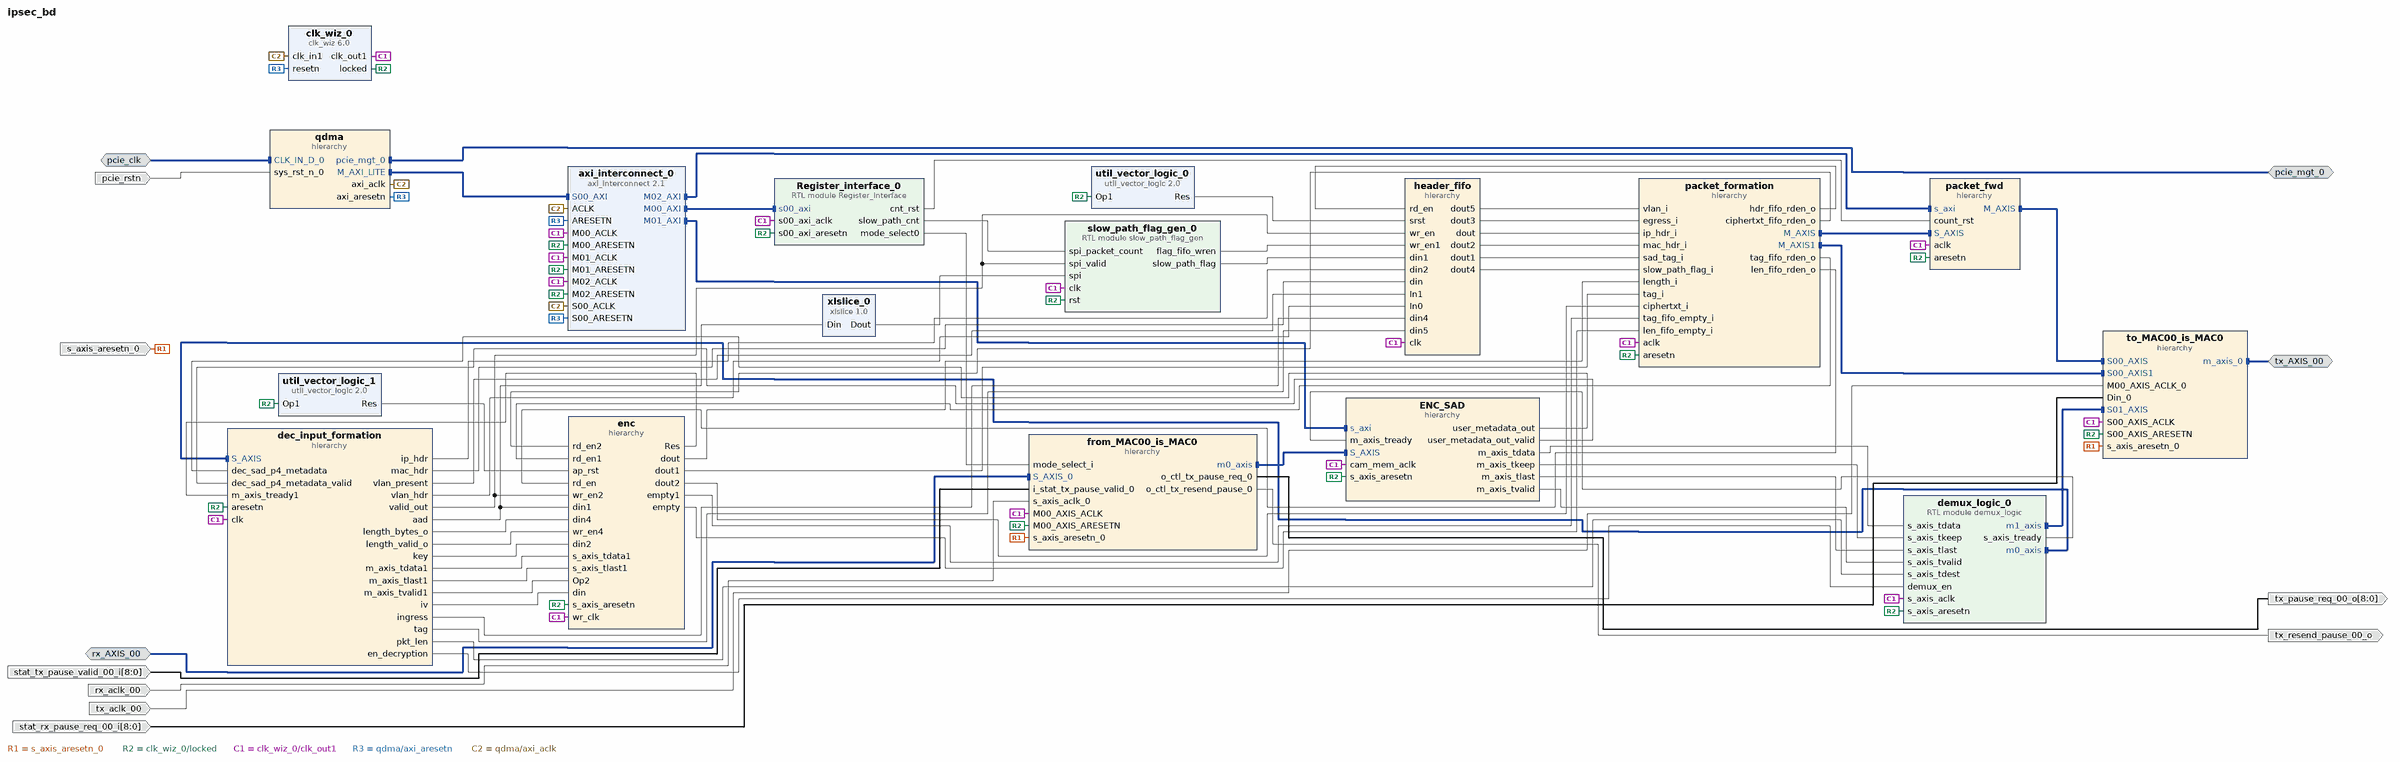
[diagram p0: block diagram of the top level]
# Vivado block design ipsec_bd, xcu25-ffvc1760-2LV-e, Vivado 2020.1_AR75245
create_bd_design ipsec_bd

create_bd_intf_port -mode Slave -vlnv xilinx.com:interface:diff_clock_rtl:1.0 pcie_clk
create_bd_intf_port -mode Master -vlnv xilinx.com:interface:pcie_7x_mgt_rtl:1.0 pcie_mgt_0
create_bd_intf_port -mode Slave -vlnv xilinx.com:interface:axis_rtl:1.0 rx_AXIS_00
set_property -dict [list \
  CONFIG.TDATA_NUM_BYTES 8 \
  CONFIG.TDEST_WIDTH 0 \
  CONFIG.TID_WIDTH 0 \
  CONFIG.TUSER_WIDTH 0 \
  CONFIG.HAS_TREADY 1 \
  CONFIG.HAS_TSTRB 0 \
  CONFIG.HAS_TKEEP 1 \
  CONFIG.HAS_TLAST 1 \
  CONFIG.LAYERED_METADATA undef \
] [get_bd_intf_ports rx_AXIS_00]
create_bd_intf_port -mode Master -vlnv xilinx.com:interface:axis_rtl:1.0 tx_AXIS_00
create_bd_port -dir I -type rst pcie_rstn
create_bd_port -dir O -from 8 -to 0 tx_pause_req_00_o
create_bd_port -dir O tx_resend_pause_00_o
create_bd_port -dir I -from 8 -to 0 stat_tx_pause_valid_00_i
create_bd_port -dir I -type rst s_axis_aresetn_0
create_bd_port -dir I -type clk rx_aclk_00
create_bd_port -dir I -type clk tx_aclk_00
create_bd_port -dir I -from 8 -to 0 stat_rx_pause_req_00_i

create_bd_cell -type ip -vlnv xilinx.com:ip:util_vector_logic:2.0 util_vector_logic_0
set_property -dict {CONFIG.C_OPERATION not CONFIG.C_SIZE 1} [get_bd_cells util_vector_logic_0]
create_bd_cell -type hier header_fifo
create_bd_cell -type hier ENC_SAD
create_bd_cell -type hier dec_input_formation
create_bd_cell -type hier enc
create_bd_cell -type hier packet_formation
create_bd_cell -type hier packet_fwd
create_bd_cell -type ip -vlnv xilinx.com:ip:axi_interconnect:2.1 axi_interconnect_0
set_property -dict {CONFIG.M02_HAS_REGSLICE 1 CONFIG.NUM_MI 3} [get_bd_cells axi_interconnect_0]
create_bd_cell -type hier qdma
create_bd_cell -type hier from_MAC00_is_MAC0
create_bd_cell -type hier to_MAC00_is_MAC0
create_bd_cell -type ip -vlnv xilinx.com:ip:clk_wiz:6.0 clk_wiz_0
set_property -dict [list \
  CONFIG.CLKIN1_JITTER_PS 40.0 \
  CONFIG.CLKOUT1_DRIVES Buffer \
  CONFIG.CLKOUT1_JITTER 93.465 \
  CONFIG.CLKOUT1_PHASE_ERROR 89.345 \
  CONFIG.CLKOUT1_REQUESTED_OUT_FREQ 333.33333 \
  CONFIG.CLKOUT2_DRIVES Buffer \
  CONFIG.CLKOUT3_DRIVES Buffer \
  CONFIG.CLKOUT4_DRIVES Buffer \
  CONFIG.CLKOUT5_DRIVES Buffer \
  CONFIG.CLKOUT6_DRIVES Buffer \
  CONFIG.CLKOUT7_DRIVES Buffer \
  CONFIG.FEEDBACK_SOURCE FDBK_AUTO \
  CONFIG.MMCM_BANDWIDTH OPTIMIZED \
  CONFIG.MMCM_CLKFBOUT_MULT_F 14.500 \
  CONFIG.MMCM_CLKIN1_PERIOD 4.000 \
  CONFIG.MMCM_CLKIN2_PERIOD 10.0 \
  CONFIG.MMCM_CLKOUT0_DIVIDE_F 3.625 \
  CONFIG.MMCM_COMPENSATION AUTO \
  CONFIG.MMCM_DIVCLK_DIVIDE 3 \
  CONFIG.PRIMITIVE MMCM \
  CONFIG.PRIM_IN_FREQ 250.000 \
  CONFIG.RESET_PORT resetn \
  CONFIG.RESET_TYPE ACTIVE_LOW \
] [get_bd_cells clk_wiz_0]
create_bd_cell -type ip -vlnv xilinx.com:ip:util_vector_logic:2.0 util_vector_logic_1
set_property -dict {CONFIG.C_OPERATION not CONFIG.C_SIZE 1} [get_bd_cells util_vector_logic_1]
create_bd_cell -type module -reference demux_logic demux_logic_0
create_bd_cell -type module -reference slow_path_flag_gen slow_path_flag_gen_0
create_bd_cell -type ip -vlnv xilinx.com:ip:xlslice:1.0 xlslice_0
set_property -dict {CONFIG.DIN_FROM 31 CONFIG.DIN_WIDTH 64 CONFIG.DOUT_WIDTH 32} [get_bd_cells xlslice_0]
create_bd_cell -type module -reference Register_interface Register_interface_0

# ---- hierarchy /header_fifo ----
current_bd_instance /header_fifo
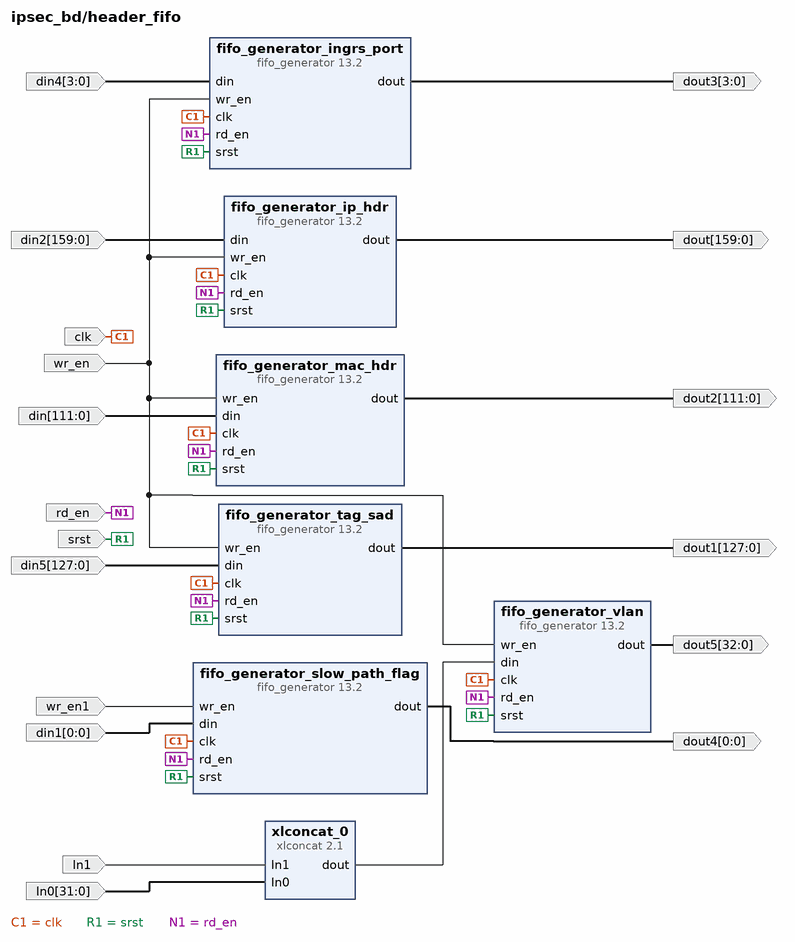
[diagram p1: block diagram inside /header_fifo]
create_bd_pin -dir I -type clk clk
create_bd_pin -dir I srst
create_bd_pin -dir I -from 111 -to 0 din
create_bd_pin -dir I wr_en
create_bd_pin -dir I -from 159 -to 0 din2
create_bd_pin -dir O -from 159 -to 0 dout
create_bd_pin -dir I rd_en
create_bd_pin -dir O -from 111 -to 0 dout2
create_bd_pin -dir I In1
create_bd_pin -dir I -from 31 -to 0 In0
create_bd_pin -dir O -from 32 -to 0 dout5
create_bd_pin -dir O -from 3 -to 0 dout3
create_bd_pin -dir I -from 3 -to 0 din4
create_bd_pin -dir I -from 127 -to 0 din5
create_bd_pin -dir I wr_en1
create_bd_pin -dir I -from 0 -to 0 din1
create_bd_pin -dir O -from 127 -to 0 dout1
create_bd_pin -dir O -from 0 -to 0 dout4

create_bd_cell -type ip -vlnv xilinx.com:ip:fifo_generator:13.2 fifo_generator_mac_hdr
set_property -dict [list \
  CONFIG.Fifo_Implementation Common_Clock_Block_RAM \
  CONFIG.Input_Data_Width 112 \
  CONFIG.Input_Depth 128 \
  CONFIG.Use_Embedded_Registers false \
] [get_bd_cells fifo_generator_mac_hdr]
create_bd_cell -type ip -vlnv xilinx.com:ip:fifo_generator:13.2 fifo_generator_ip_hdr
set_property -dict [list \
  CONFIG.Fifo_Implementation Common_Clock_Block_RAM \
  CONFIG.Input_Data_Width 160 \
  CONFIG.Input_Depth 128 \
  CONFIG.Use_Embedded_Registers false \
] [get_bd_cells fifo_generator_ip_hdr]
create_bd_cell -type ip -vlnv xilinx.com:ip:xlconcat:2.1 xlconcat_0
set_property -dict {CONFIG.IN0_WIDTH 32 CONFIG.IN1_WIDTH 1} [get_bd_cells xlconcat_0]
create_bd_cell -type ip -vlnv xilinx.com:ip:fifo_generator:13.2 fifo_generator_vlan
set_property -dict [list \
  CONFIG.Fifo_Implementation Common_Clock_Builtin_FIFO \
  CONFIG.Input_Data_Width 33 \
  CONFIG.Input_Depth 512 \
  CONFIG.Performance_Options Standard_FIFO \
  CONFIG.Use_Embedded_Registers false \
] [get_bd_cells fifo_generator_vlan]
create_bd_cell -type ip -vlnv xilinx.com:ip:fifo_generator:13.2 fifo_generator_ingrs_port
set_property -dict [list \
  CONFIG.Fifo_Implementation Common_Clock_Block_RAM \
  CONFIG.Input_Data_Width 4 \
  CONFIG.Input_Depth 128 \
  CONFIG.Performance_Options Standard_FIFO \
  CONFIG.Use_Embedded_Registers false \
] [get_bd_cells fifo_generator_ingrs_port]
create_bd_cell -type ip -vlnv xilinx.com:ip:fifo_generator:13.2 fifo_generator_tag_sad
set_property -dict [list \
  CONFIG.Fifo_Implementation Common_Clock_Block_RAM \
  CONFIG.Input_Data_Width 128 \
  CONFIG.Input_Depth 128 \
  CONFIG.Performance_Options Standard_FIFO \
  CONFIG.Use_Embedded_Registers false \
] [get_bd_cells fifo_generator_tag_sad]
create_bd_cell -type ip -vlnv xilinx.com:ip:fifo_generator:13.2 fifo_generator_slow_path_flag
set_property -dict [list \
  CONFIG.Fifo_Implementation Common_Clock_Block_RAM \
  CONFIG.Input_Data_Width 1 \
  CONFIG.Input_Depth 128 \
  CONFIG.Performance_Options Standard_FIFO \
  CONFIG.Use_Embedded_Registers false \
] [get_bd_cells fifo_generator_slow_path_flag]

# ---- hierarchy /ENC_SAD ----
current_bd_instance /ENC_SAD
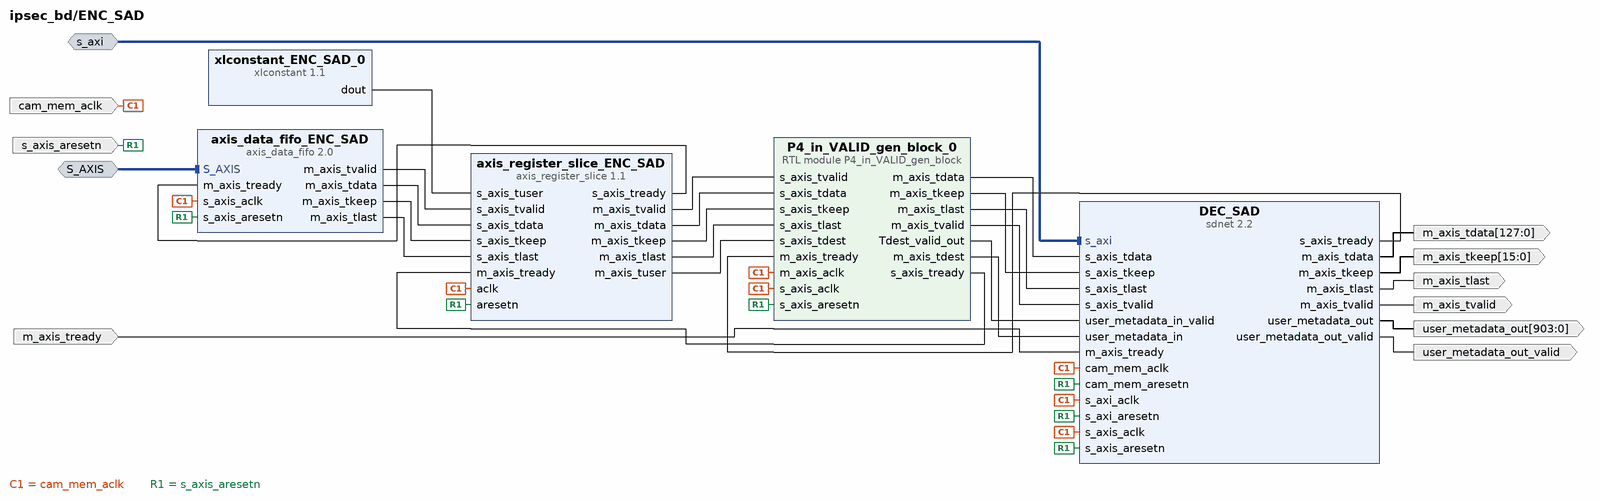
[diagram p2: block diagram inside /ENC_SAD]
create_bd_intf_pin -mode Slave -vlnv xilinx.com:interface:aximm_rtl:1.0 s_axi
create_bd_intf_pin -mode Slave -vlnv xilinx.com:interface:axis_rtl:1.0 S_AXIS
create_bd_pin -dir I -type clk cam_mem_aclk
create_bd_pin -dir I -type rst s_axis_aresetn
create_bd_pin -dir O -from 127 -to 0 m_axis_tdata
create_bd_pin -dir O -from 15 -to 0 m_axis_tkeep
create_bd_pin -dir O m_axis_tlast
create_bd_pin -dir O m_axis_tvalid
create_bd_pin -dir I m_axis_tready
create_bd_pin -dir O -from 903 -to 0 user_metadata_out
create_bd_pin -dir O user_metadata_out_valid

create_bd_cell -type ip -vlnv xilinx.com:ip:axis_register_slice:1.1 axis_register_slice_ENC_SAD
set_property -dict [list \
  CONFIG.HAS_TKEEP 1 \
  CONFIG.HAS_TLAST 1 \
  CONFIG.TDATA_NUM_BYTES 16 \
  CONFIG.TUSER_WIDTH 904 \
] [get_bd_cells axis_register_slice_ENC_SAD]
create_bd_cell -type ip -vlnv xilinx.com:ip:xlconstant:1.1 xlconstant_ENC_SAD_0
set_property -dict {CONFIG.CONST_VAL 0 CONFIG.CONST_WIDTH 904} [get_bd_cells xlconstant_ENC_SAD_0]
create_bd_cell -type ip -vlnv xilinx.com:ip:axis_data_fifo:2.0 axis_data_fifo_ENC_SAD
set_property -dict [list \
  CONFIG.FIFO_DEPTH 64 \
  CONFIG.HAS_TKEEP 1 \
  CONFIG.HAS_TLAST 1 \
  CONFIG.TDATA_NUM_BYTES 16 \
] [get_bd_cells axis_data_fifo_ENC_SAD]
create_bd_cell -type module -reference P4_in_VALID_gen_block P4_in_VALID_gen_block_0
set_property -dict {CONFIG.TDEST_SIZE 904} [get_bd_cells P4_in_VALID_gen_block_0]
create_bd_cell -type ip -vlnv xilinx.com:ip:sdnet:2.2 DEC_SAD
set_property -dict [list \
  CONFIG.AXIS_CLK_FREQ_MHZ 333 \
  CONFIG.CAM_MEM_CLK_ENABLE 1 \
  CONFIG.CAM_TABLE_PARAMS {MyProcessing.sad {ram_style GLOBAL clock CAM mode BCAM opt GLOBAL}} \
  CONFIG.JSON_TIMESTAMP 1601540136 \
  CONFIG.M_AXI_HBM_ADDR_WIDTH 33 \
  CONFIG.M_AXI_HBM_DATA_WIDTH 256 \
  CONFIG.M_AXI_HBM_ID_WIDTH 6 \
  CONFIG.M_AXI_HBM_PROTOCOL 0 \
  CONFIG.P4_FILE /home/merin.baby/merin/xilu_u25b_ipsec/IPSEC_DEC_C0_08/IP/p4/sad_dec_new_A0_00.p4 \
  CONFIG.PKT_RATE 150 \
  CONFIG.S_AXI_ADDR_WIDTH 13 \
  CONFIG.TDATA_NUM_BYTES 16 \
  CONFIG.USER_METADATA_ENABLES {metadata.ingress_port {input true output true} metadata.length {input true output true} metadata.ip_header {input true output true} metadata.vlan_header {input true output true} metadata.mac_header {input true output true} metadata.tag_met {input true output true} metadata.iv {input true output true} metadata.aad {input true output true} metadata.int_iv {input true output true} metadata.dec_key {input true output true} metadata.is_vlan {input true output true} metadata.en_fwd {input true output true} metadata.en_encrypt {input true output true} metadata.hit_test {input true output true}} \
  CONFIG.USER_META_DATA_WIDTH 904 \
  CONFIG.USER_META_FORMAT {metadata.ingress_port {length 4 start 0 end 3} metadata.length {length 16 start 4 end 19} metadata.ip_header {length 160 start 20 end 179} metadata.vlan_header {length 32 start 180 end 211} metadata.mac_header {length 112 start 212 end 323} metadata.tag_met {length 128 start 324 end 451} metadata.iv {length 96 start 452 end 547} metadata.aad {length 64 start 548 end 611} metadata.int_iv {length 32 start 612 end 643} metadata.dec_key {length 256 start 644 end 899} metadata.is_vlan {length 1 start 900 end 900} metadata.en_fwd {length 1 start 901 end 901} metadata.en_encrypt {length 1 start 902 end 902} metadata.hit_test {length 1 start 903 end 903}} \
] [get_bd_cells DEC_SAD]

# ---- hierarchy /dec_input_formation ----
current_bd_instance /dec_input_formation
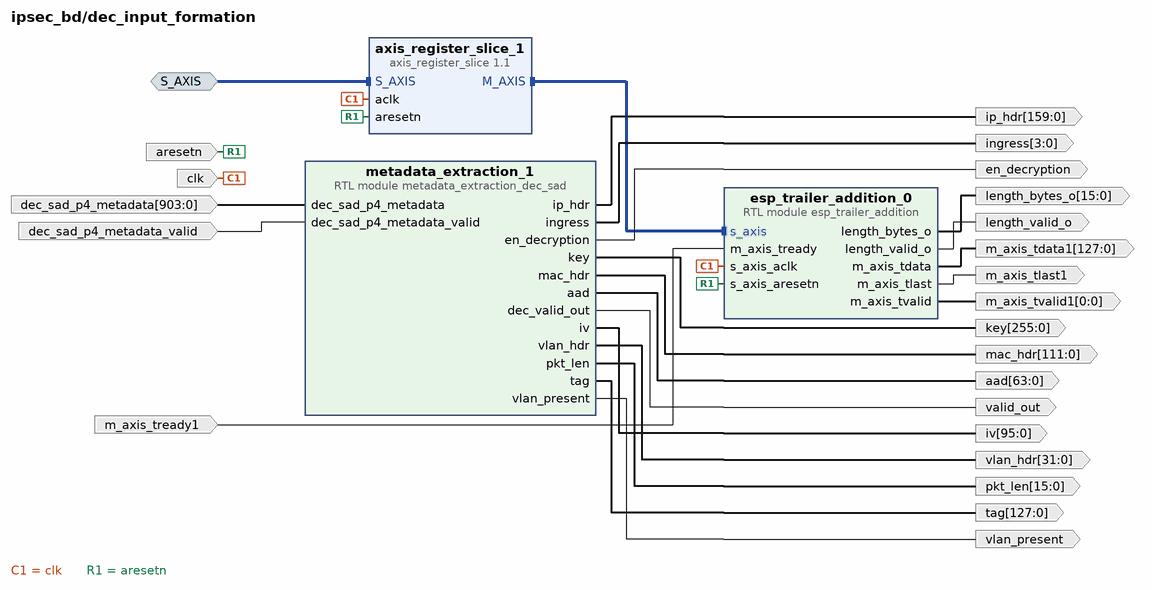
[diagram p3: block diagram inside /dec_input_formation]
create_bd_intf_pin -mode Slave -vlnv xilinx.com:interface:axis_rtl:1.0 S_AXIS
create_bd_pin -dir I -type clk clk
create_bd_pin -dir I -type rst aresetn
create_bd_pin -dir O -from 15 -to 0 length_bytes_o
create_bd_pin -dir O length_valid_o
create_bd_pin -dir O -from 159 -to 0 ip_hdr
create_bd_pin -dir O valid_out
create_bd_pin -dir O -from 111 -to 0 mac_hdr
create_bd_pin -dir O -from 255 -to 0 key
create_bd_pin -dir O -from 15 -to 0 pkt_len
create_bd_pin -dir O vlan_present
create_bd_pin -dir O -from 31 -to 0 vlan_hdr
create_bd_pin -dir O -from 127 -to 0 m_axis_tdata1
create_bd_pin -dir O m_axis_tlast1
create_bd_pin -dir I m_axis_tready1
create_bd_pin -dir O -from 0 -to 0 m_axis_tvalid1
create_bd_pin -dir I -from 903 -to 0 dec_sad_p4_metadata
create_bd_pin -dir I dec_sad_p4_metadata_valid
create_bd_pin -dir O -from 3 -to 0 ingress
create_bd_pin -dir O en_decryption
create_bd_pin -dir O -from 127 -to 0 tag
create_bd_pin -dir O -from 95 -to 0 iv
create_bd_pin -dir O -from 63 -to 0 aad

create_bd_cell -type module -reference esp_trailer_addition esp_trailer_addition_0
create_bd_cell -type ip -vlnv xilinx.com:ip:axis_register_slice:1.1 axis_register_slice_1
set_property -dict [list \
  CONFIG.HAS_TKEEP 1 \
  CONFIG.HAS_TLAST 1 \
  CONFIG.TDATA_NUM_BYTES 16 \
  CONFIG.TDEST_WIDTH 16 \
] [get_bd_cells axis_register_slice_1]
create_bd_cell -type module -reference metadata_extraction_dec_sad metadata_extraction_1

# ---- hierarchy /enc ----
current_bd_instance /enc
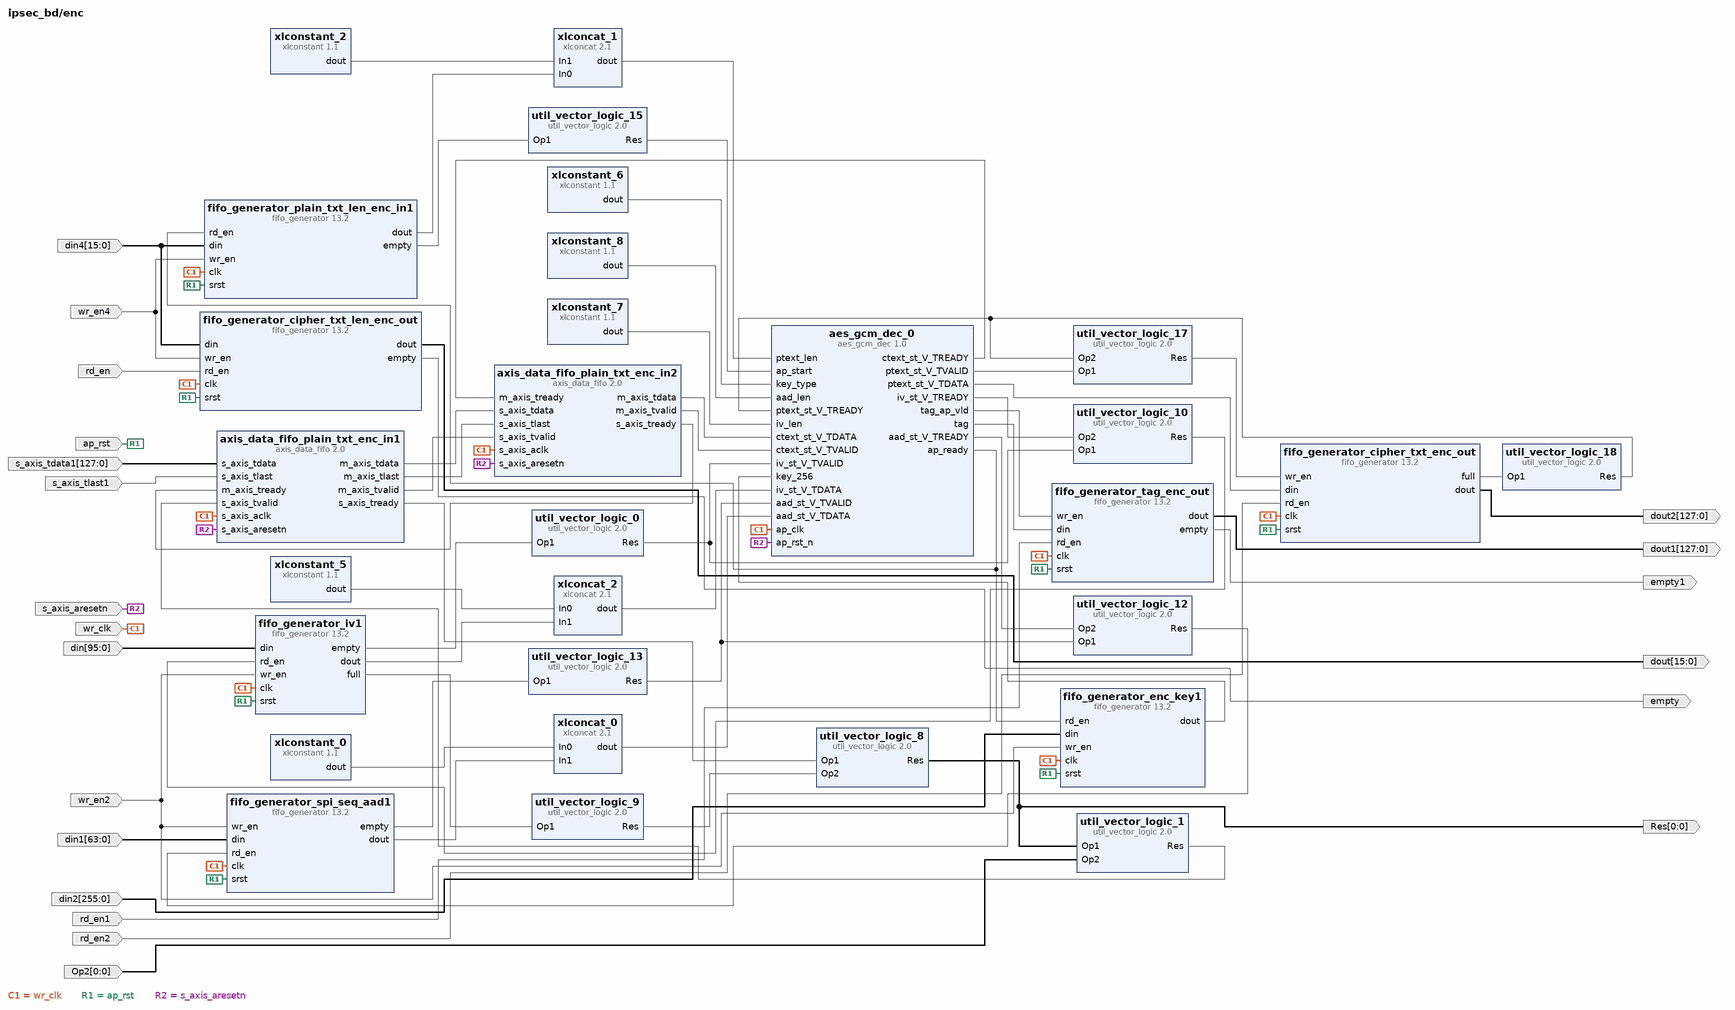
[diagram p4: block diagram inside /enc]
create_bd_pin -dir I -from 95 -to 0 din
create_bd_pin -dir I -from 255 -to 0 din2
create_bd_pin -dir I wr_en2
create_bd_pin -dir I -from 15 -to 0 din4
create_bd_pin -dir I wr_en4
create_bd_pin -dir O -from 15 -to 0 dout
create_bd_pin -dir O empty
create_bd_pin -dir I rd_en
create_bd_pin -dir I rd_en1
create_bd_pin -dir O empty1
create_bd_pin -dir O -from 127 -to 0 dout1
create_bd_pin -dir O -from 127 -to 0 dout2
create_bd_pin -dir I rd_en2
create_bd_pin -dir I -type rst ap_rst
create_bd_pin -dir I -type clk wr_clk
create_bd_pin -dir I -type rst s_axis_aresetn
create_bd_pin -dir I -from 127 -to 0 s_axis_tdata1
create_bd_pin -dir I s_axis_tlast1
create_bd_pin -dir O -from 0 -to 0 Res
create_bd_pin -dir I -from 0 -to 0 Op2
create_bd_pin -dir I -from 63 -to 0 din1

create_bd_cell -type ip -vlnv xilinx.com:ip:fifo_generator:13.2 fifo_generator_cipher_txt_len_enc_out
set_property -dict [list \
  CONFIG.Fifo_Implementation Common_Clock_Block_RAM \
  CONFIG.Input_Data_Width 16 \
  CONFIG.Input_Depth 128 \
  CONFIG.Performance_Options Standard_FIFO \
  CONFIG.Reset_Type Synchronous_Reset \
  CONFIG.Use_Embedded_Registers false \
  CONFIG.Valid_Flag false \
] [get_bd_cells fifo_generator_cipher_txt_len_enc_out]
create_bd_cell -type ip -vlnv xilinx.com:ip:fifo_generator:13.2 fifo_generator_tag_enc_out
set_property -dict [list \
  CONFIG.Fifo_Implementation Common_Clock_Block_RAM \
  CONFIG.Input_Data_Width 128 \
  CONFIG.Input_Depth 64 \
  CONFIG.Performance_Options Standard_FIFO \
  CONFIG.Reset_Type Synchronous_Reset \
  CONFIG.Use_Embedded_Registers false \
  CONFIG.Valid_Flag false \
] [get_bd_cells fifo_generator_tag_enc_out]
create_bd_cell -type ip -vlnv xilinx.com:ip:fifo_generator:13.2 fifo_generator_cipher_txt_enc_out
set_property -dict [list \
  CONFIG.Fifo_Implementation Common_Clock_Block_RAM \
  CONFIG.Input_Data_Width 128 \
  CONFIG.Input_Depth 256 \
  CONFIG.Performance_Options Standard_FIFO \
  CONFIG.Reset_Type Synchronous_Reset \
  CONFIG.Use_Embedded_Registers false \
  CONFIG.Valid_Flag false \
] [get_bd_cells fifo_generator_cipher_txt_enc_out]
create_bd_cell -type ip -vlnv xilinx.com:ip:util_vector_logic:2.0 util_vector_logic_0
set_property -dict {CONFIG.C_OPERATION not CONFIG.C_SIZE 1} [get_bd_cells util_vector_logic_0]
create_bd_cell -type ip -vlnv xilinx.com:ip:xlconcat:2.1 xlconcat_0
set_property -dict {CONFIG.IN0_WIDTH 64 CONFIG.IN1_WIDTH 64} [get_bd_cells xlconcat_0]
create_bd_cell -type ip -vlnv xilinx.com:ip:xlconstant:1.1 xlconstant_0
set_property -dict {CONFIG.CONST_VAL 0 CONFIG.CONST_WIDTH 64} [get_bd_cells xlconstant_0]
create_bd_cell -type ip -vlnv xilinx.com:ip:xlconcat:2.1 xlconcat_1
set_property -dict {CONFIG.IN0_WIDTH 16 CONFIG.IN1_WIDTH 48 CONFIG.IN2_WIDTH 45 CONFIG.NUM_PORTS 2} [get_bd_cells xlconcat_1]
create_bd_cell -type ip -vlnv xilinx.com:ip:xlconstant:1.1 xlconstant_2
set_property -dict {CONFIG.CONST_VAL 0 CONFIG.CONST_WIDTH 48} [get_bd_cells xlconstant_2]
create_bd_cell -type ip -vlnv xilinx.com:ip:axis_data_fifo:2.0 axis_data_fifo_plain_txt_enc_in1
set_property -dict [list \
  CONFIG.FIFO_DEPTH 512 \
  CONFIG.FIFO_MODE 2 \
  CONFIG.HAS_TKEEP 0 \
  CONFIG.TDATA_NUM_BYTES 16 \
  CONFIG.TDEST_WIDTH 0 \
] [get_bd_cells axis_data_fifo_plain_txt_enc_in1]
create_bd_cell -type ip -vlnv xilinx.com:ip:util_vector_logic:2.0 util_vector_logic_8
set_property -dict {CONFIG.C_SIZE 1} [get_bd_cells util_vector_logic_8]
create_bd_cell -type ip -vlnv xilinx.com:ip:util_vector_logic:2.0 util_vector_logic_9
set_property -dict {CONFIG.C_OPERATION not CONFIG.C_SIZE 1} [get_bd_cells util_vector_logic_9]
create_bd_cell -type ip -vlnv xilinx.com:ip:axis_data_fifo:2.0 axis_data_fifo_plain_txt_enc_in2
set_property -dict [list \
  CONFIG.FIFO_DEPTH 1024 \
  CONFIG.FIFO_MODE 2 \
  CONFIG.HAS_TKEEP 0 \
  CONFIG.IS_ACLK_ASYNC 0 \
  CONFIG.TDATA_NUM_BYTES 16 \
  CONFIG.TDEST_WIDTH 0 \
] [get_bd_cells axis_data_fifo_plain_txt_enc_in2]
create_bd_cell -type ip -vlnv xilinx.com:ip:xlconcat:2.1 xlconcat_2
set_property -dict {CONFIG.IN0_WIDTH 32 CONFIG.IN1_WIDTH 96} [get_bd_cells xlconcat_2]
create_bd_cell -type ip -vlnv xilinx.com:ip:xlconstant:1.1 xlconstant_5
set_property -dict {CONFIG.CONST_VAL 0 CONFIG.CONST_WIDTH 32} [get_bd_cells xlconstant_5]
create_bd_cell -type ip -vlnv xilinx.com:ip:util_vector_logic:2.0 util_vector_logic_10
set_property -dict {CONFIG.C_SIZE 1} [get_bd_cells util_vector_logic_10]
create_bd_cell -type ip -vlnv xilinx.com:ip:fifo_generator:13.2 fifo_generator_iv1
set_property -dict [list \
  CONFIG.Fifo_Implementation Common_Clock_Block_RAM \
  CONFIG.Input_Data_Width 96 \
  CONFIG.Input_Depth 64 \
  CONFIG.Performance_Options First_Word_Fall_Through \
  CONFIG.Reset_Type Synchronous_Reset \
  CONFIG.Use_Embedded_Registers false \
  CONFIG.Valid_Flag false \
] [get_bd_cells fifo_generator_iv1]
create_bd_cell -type ip -vlnv xilinx.com:ip:util_vector_logic:2.0 util_vector_logic_12
set_property -dict {CONFIG.C_SIZE 1} [get_bd_cells util_vector_logic_12]
create_bd_cell -type ip -vlnv xilinx.com:ip:util_vector_logic:2.0 util_vector_logic_13
set_property -dict {CONFIG.C_OPERATION not CONFIG.C_SIZE 1} [get_bd_cells util_vector_logic_13]
create_bd_cell -type ip -vlnv xilinx.com:ip:fifo_generator:13.2 fifo_generator_enc_key1
set_property -dict [list \
  CONFIG.Fifo_Implementation Common_Clock_Block_RAM \
  CONFIG.Input_Data_Width 256 \
  CONFIG.Input_Depth 128 \
  CONFIG.Performance_Options First_Word_Fall_Through \
  CONFIG.Reset_Type Synchronous_Reset \
  CONFIG.Use_Embedded_Registers false \
  CONFIG.Valid_Flag false \
] [get_bd_cells fifo_generator_enc_key1]
create_bd_cell -type ip -vlnv xilinx.com:ip:util_vector_logic:2.0 util_vector_logic_15
set_property -dict {CONFIG.C_OPERATION not CONFIG.C_SIZE 1} [get_bd_cells util_vector_logic_15]
create_bd_cell -type ip -vlnv xilinx.com:ip:xlconstant:1.1 xlconstant_6
set_property -dict {CONFIG.CONST_VAL 2 CONFIG.CONST_WIDTH 8} [get_bd_cells xlconstant_6]
create_bd_cell -type ip -vlnv xilinx.com:ip:xlconstant:1.1 xlconstant_7
set_property -dict {CONFIG.CONST_VAL 0x0c CONFIG.CONST_WIDTH 64} [get_bd_cells xlconstant_7]
create_bd_cell -type ip -vlnv xilinx.com:ip:xlconstant:1.1 xlconstant_8
set_property -dict {CONFIG.CONST_VAL 0x10 CONFIG.CONST_WIDTH 64} [get_bd_cells xlconstant_8]
create_bd_cell -type ip -vlnv xilinx.com:ip:fifo_generator:13.2 fifo_generator_plain_txt_len_enc_in1
set_property -dict [list \
  CONFIG.Fifo_Implementation Common_Clock_Block_RAM \
  CONFIG.Input_Data_Width 16 \
  CONFIG.Input_Depth 512 \
  CONFIG.Performance_Options First_Word_Fall_Through \
  CONFIG.Reset_Type Synchronous_Reset \
  CONFIG.Use_Embedded_Registers false \
  CONFIG.Valid_Flag false \
] [get_bd_cells fifo_generator_plain_txt_len_enc_in1]
create_bd_cell -type ip -vlnv xilinx.com:ip:util_vector_logic:2.0 util_vector_logic_17
set_property -dict {CONFIG.C_SIZE 1} [get_bd_cells util_vector_logic_17]
create_bd_cell -type ip -vlnv xilinx.com:ip:util_vector_logic:2.0 util_vector_logic_18
set_property -dict {CONFIG.C_OPERATION not CONFIG.C_SIZE 1} [get_bd_cells util_vector_logic_18]
create_bd_cell -type ip -vlnv xilinx.com:ip:util_vector_logic:2.0 util_vector_logic_1
set_property -dict {CONFIG.C_SIZE 1} [get_bd_cells util_vector_logic_1]
create_bd_cell -type ip -vlnv xilinx.com:hls:aes_gcm_dec:1.0 aes_gcm_dec_0
create_bd_cell -type ip -vlnv xilinx.com:ip:fifo_generator:13.2 fifo_generator_spi_seq_aad1
set_property -dict [list \
  CONFIG.Fifo_Implementation Common_Clock_Block_RAM \
  CONFIG.Input_Data_Width 64 \
  CONFIG.Input_Depth 64 \
  CONFIG.Performance_Options First_Word_Fall_Through \
  CONFIG.Reset_Type Synchronous_Reset \
  CONFIG.Use_Embedded_Registers false \
  CONFIG.Valid_Flag false \
] [get_bd_cells fifo_generator_spi_seq_aad1]

# ---- hierarchy /packet_formation ----
current_bd_instance /packet_formation
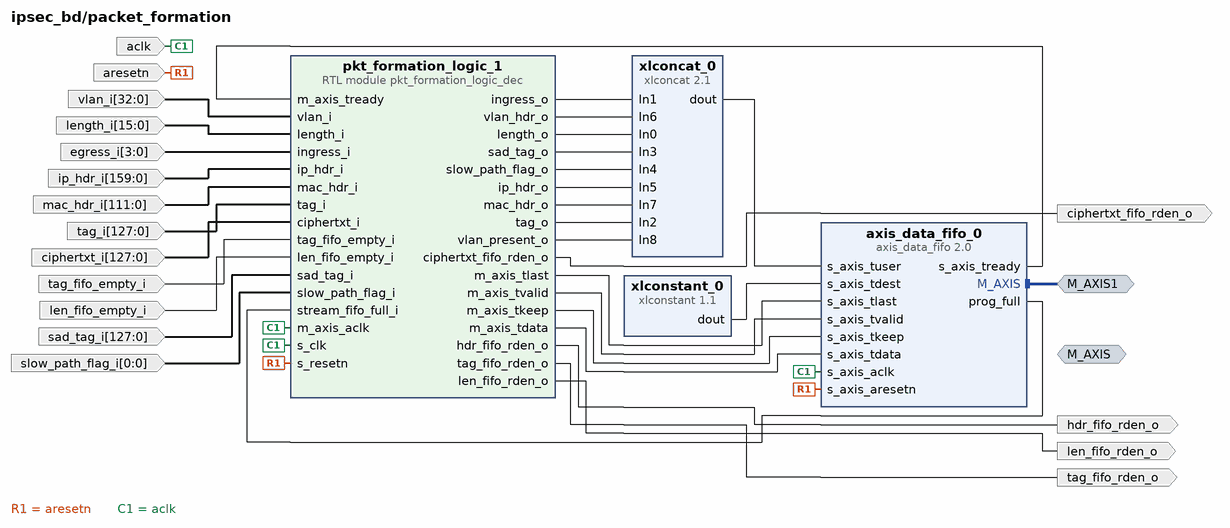
[diagram p5: block diagram inside /packet_formation]
create_bd_intf_pin -mode Master -vlnv xilinx.com:interface:axis_rtl:1.0 M_AXIS
create_bd_intf_pin -mode Master -vlnv xilinx.com:interface:axis_rtl:1.0 M_AXIS1
create_bd_pin -dir I -type rst aresetn
create_bd_pin -dir I -type clk aclk
create_bd_pin -dir O ciphertxt_fifo_rden_o
create_bd_pin -dir O tag_fifo_rden_o
create_bd_pin -dir O hdr_fifo_rden_o
create_bd_pin -dir O len_fifo_rden_o
create_bd_pin -dir I -from 32 -to 0 vlan_i
create_bd_pin -dir I -from 15 -to 0 length_i
create_bd_pin -dir I -from 3 -to 0 egress_i
create_bd_pin -dir I -from 159 -to 0 ip_hdr_i
create_bd_pin -dir I -from 111 -to 0 mac_hdr_i
create_bd_pin -dir I -from 127 -to 0 tag_i
create_bd_pin -dir I -from 127 -to 0 ciphertxt_i
create_bd_pin -dir I tag_fifo_empty_i
create_bd_pin -dir I len_fifo_empty_i
create_bd_pin -dir I -from 127 -to 0 sad_tag_i
create_bd_pin -dir I -from 0 -to 0 slow_path_flag_i

create_bd_cell -type ip -vlnv xilinx.com:ip:axis_data_fifo:2.0 axis_data_fifo_0
set_property -dict [list \
  CONFIG.FIFO_DEPTH 2048 \
  CONFIG.HAS_PROG_FULL 1 \
  CONFIG.HAS_TKEEP 1 \
  CONFIG.HAS_TLAST 1 \
  CONFIG.PROG_FULL_THRESH 1800 \
  CONFIG.TDATA_NUM_BYTES 16 \
  CONFIG.TDEST_WIDTH 16 \
  CONFIG.TUSER_WIDTH 581 \
] [get_bd_cells axis_data_fifo_0]
create_bd_cell -type ip -vlnv xilinx.com:ip:xlconcat:2.1 xlconcat_0
set_property -dict [list \
  CONFIG.IN0_WIDTH 16 \
  CONFIG.IN1_WIDTH 4 \
  CONFIG.IN2_WIDTH 128 \
  CONFIG.IN3_WIDTH 64 \
  CONFIG.IN4_WIDTH 64 \
  CONFIG.IN5_WIDTH 160 \
  CONFIG.IN6_WIDTH 32 \
  CONFIG.IN7_WIDTH 112 \
  CONFIG.IN8_WIDTH 1 \
  CONFIG.NUM_PORTS 9 \
] [get_bd_cells xlconcat_0]
create_bd_cell -type ip -vlnv xilinx.com:ip:xlconstant:1.1 xlconstant_0
set_property -dict {CONFIG.CONST_VAL 0 CONFIG.CONST_WIDTH 16} [get_bd_cells xlconstant_0]
create_bd_cell -type module -reference pkt_formation_logic_dec pkt_formation_logic_1

# ---- hierarchy /packet_fwd ----
current_bd_instance /packet_fwd
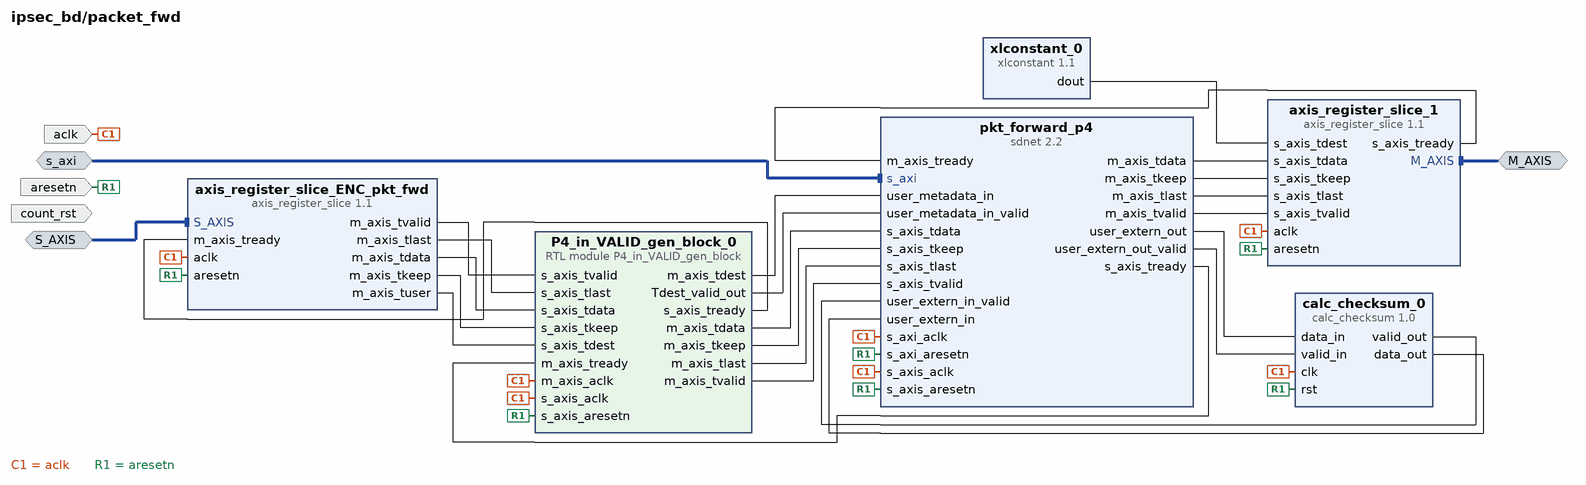
[diagram p6: block diagram inside /packet_fwd]
create_bd_intf_pin -mode Master -vlnv xilinx.com:interface:axis_rtl:1.0 M_AXIS
create_bd_intf_pin -mode Slave -vlnv xilinx.com:interface:aximm_rtl:1.0 s_axi
create_bd_intf_pin -mode Slave -vlnv xilinx.com:interface:axis_rtl:1.0 S_AXIS
create_bd_pin -dir I -type clk aclk
create_bd_pin -dir I -type rst aresetn
create_bd_pin -dir I -type rst count_rst

create_bd_cell -type ip -vlnv xilinx.com:ip:axis_register_slice:1.1 axis_register_slice_ENC_pkt_fwd
set_property -dict [list \
  CONFIG.HAS_TKEEP 1 \
  CONFIG.HAS_TLAST 1 \
  CONFIG.TDATA_NUM_BYTES 16 \
  CONFIG.TUSER_WIDTH 581 \
] [get_bd_cells axis_register_slice_ENC_pkt_fwd]
create_bd_cell -type ip -vlnv xilinx.com:ip:axis_register_slice:1.1 axis_register_slice_1
set_property -dict {CONFIG.TDATA_NUM_BYTES 16} [get_bd_cells axis_register_slice_1]
create_bd_cell -type ip -vlnv xilinx.com:ip:xlconstant:1.1 xlconstant_0
set_property -dict {CONFIG.CONST_VAL 0 CONFIG.CONST_WIDTH 16} [get_bd_cells xlconstant_0]
create_bd_cell -type ip -vlnv user.org:user:calc_checksum:1.0 calc_checksum_0
create_bd_cell -type ip -vlnv xilinx.com:ip:sdnet:2.2 pkt_forward_p4
set_property -dict [list \
  CONFIG.AXIS_CLK_FREQ_MHZ 333 \
  CONFIG.JSON_TIMESTAMP 1601388755 \
  CONFIG.M_AXI_HBM_ADDR_WIDTH 33 \
  CONFIG.M_AXI_HBM_DATA_WIDTH 256 \
  CONFIG.M_AXI_HBM_ID_WIDTH 6 \
  CONFIG.M_AXI_HBM_PROTOCOL 0 \
  CONFIG.NUM_USER_EXTERNS 1 \
  CONFIG.P4_FILE /home/merin.baby/merin/xilu_u25b_ipsec/IPSEC_ENC_A0_16/IP/p4/PKT_FORWARD_ENC_A0_03.p4 \
  CONFIG.PKT_RATE 333 \
  CONFIG.S_AXI_ADDR_WIDTH 1 \
  CONFIG.TDATA_NUM_BYTES 16 \
  CONFIG.USER_EXTERNS {calc_checksum {out_substruct ipv4_header_0 latency 6 input_width 160 output_width 16}} \
  CONFIG.USER_EXTERN_IN_WIDTH 16 \
  CONFIG.USER_EXTERN_OUT_WIDTH 160 \
  CONFIG.USER_METADATA_ENABLES {metadata.len {input true output true} metadata.egress_port {input true output true} metadata.tag_header {input true output true} metadata.ext_iv {input true output true} metadata.esp_header {input true output true} metadata.dst_2 {input true output true} metadata.dst_1 {input true output true} metadata.src_2 {input true output true} metadata.src_1 {input true output true} metadata.hdr_chk {input true output true} metadata.protocol {input true output true} metadata.ttl {input true output true} metadata.offset {input true output true} metadata.flags {input true output true} metadata.id {input true output true} metadata.length {input true output true} metadata.tos {input true output true} metadata.hdr_len {input true output true} metadata.version {input true output true} metadata.vlan_header {input true output true} metadata.mac_header {input true output true} metadata.is_vlan {input true output true}} \
  CONFIG.USER_META_DATA_WIDTH 581 \
  CONFIG.USER_META_FORMAT {metadata.len {length 16 start 0 end 15} metadata.egress_port {length 4 start 16 end 19} metadata.tag_header {length 128 start 20 end 147} metadata.ext_iv {length 64 start 148 end 211} metadata.esp_header {length 64 start 212 end 275} metadata.dst_2 {length 16 start 276 end 291} metadata.dst_1 {length 16 start 292 end 307} metadata.src_2 {length 16 start 308 end 323} metadata.src_1 {length 16 start 324 end 339} metadata.hdr_chk {length 16 start 340 end 355} metadata.protocol {length 8 start 356 end 363} metadata.ttl {length 8 start 364 end 371} metadata.offset {length 13 start 372 end 384} metadata.flags {length 3 start 385 end 387} metadata.id {length 16 start 388 end 403} metadata.length {length 16 start 404 end 419} metadata.tos {length 8 start 420 end 427} metadata.hdr_len {length 4 start 428 end 431} metadata.version {length 4 start 432 end 435} metadata.vlan_header {length 32 start 436 end 467} metadata.mac_header {length 112 start 468 end 579} metadata.is_vlan {length 1 start 580 end 580}} \
] [get_bd_cells pkt_forward_p4]
create_bd_cell -type module -reference P4_in_VALID_gen_block P4_in_VALID_gen_block_0
set_property -dict {CONFIG.TDEST_SIZE 581} [get_bd_cells P4_in_VALID_gen_block_0]

# ---- hierarchy /qdma ----
current_bd_instance /qdma
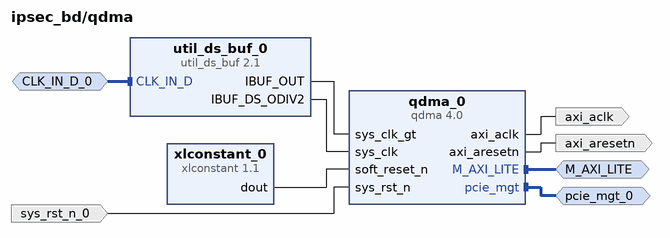
[diagram p7: block diagram inside /qdma]
create_bd_intf_pin -mode Slave -vlnv xilinx.com:interface:diff_clock_rtl:1.0 CLK_IN_D_0
create_bd_intf_pin -mode Master -vlnv xilinx.com:interface:pcie_7x_mgt_rtl:1.0 pcie_mgt_0
create_bd_intf_pin -mode Master -vlnv xilinx.com:interface:aximm_rtl:1.0 M_AXI_LITE
create_bd_pin -dir I -type rst sys_rst_n_0
create_bd_pin -dir O -type rst axi_aresetn
create_bd_pin -dir O -type clk axi_aclk

create_bd_cell -type ip -vlnv xilinx.com:ip:util_ds_buf:2.1 util_ds_buf_0
set_property -dict {CONFIG.C_BUF_TYPE IBUFDSGTE} [get_bd_cells util_ds_buf_0]
create_bd_cell -type ip -vlnv xilinx.com:ip:xlconstant:1.1 xlconstant_0
create_bd_cell -type ip -vlnv xilinx.com:ip:qdma:4.0 qdma_0
set_property -dict [list \
  CONFIG.PF0_SRIOV_VF_DEVICE_ID A038 \
  CONFIG.axi_data_width 128_bit \
  CONFIG.dma_intf_sel_qdma AXI_Stream_with_Completion \
  CONFIG.en_axi_mm_qdma false \
  CONFIG.en_gt_selection true \
  CONFIG.mode_selection Advanced \
  CONFIG.pcie_blk_locn X1Y0 \
  CONFIG.pf0_bar2_scale_qdma Megabytes \
  CONFIG.pf0_device_id 9028 \
  CONFIG.pf2_device_id 9228 \
  CONFIG.pf3_device_id 9328 \
  CONFIG.pl_link_cap_max_link_width X8 \
  CONFIG.select_quad GTH_Quad_225 \
  CONFIG.testname st \
] [get_bd_cells qdma_0]

# ---- hierarchy /from_MAC00_is_MAC0 ----
current_bd_instance /from_MAC00_is_MAC0
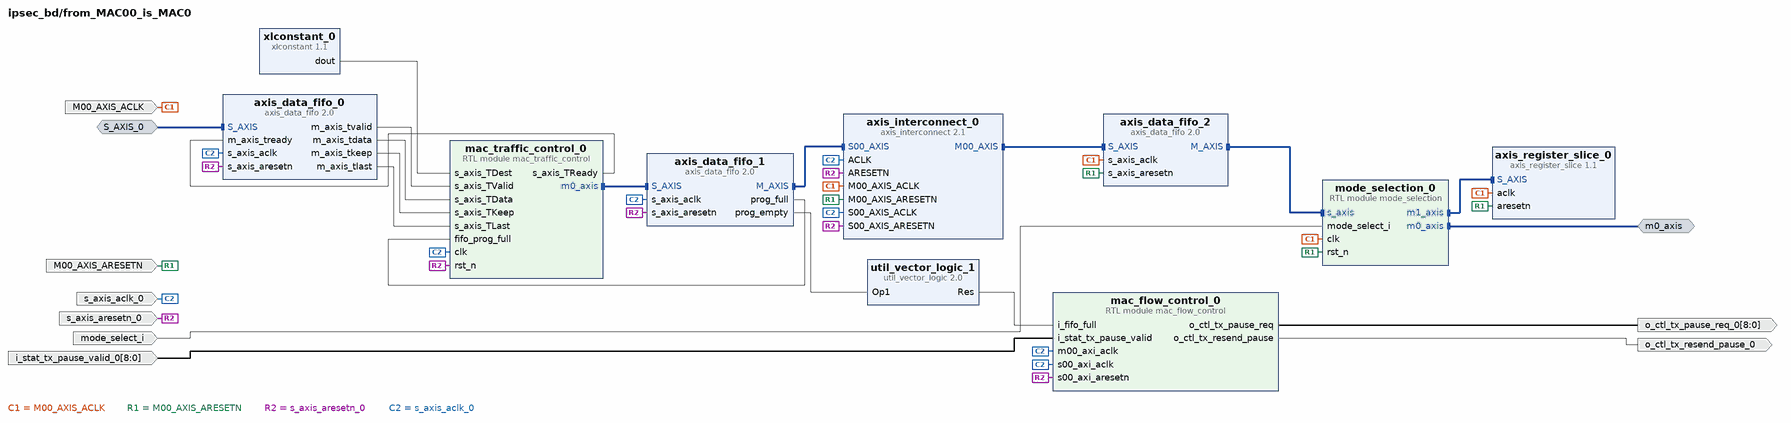
[diagram p8: block diagram inside /from_MAC00_is_MAC0]
create_bd_intf_pin -mode Slave -vlnv xilinx.com:interface:axis_rtl:1.0 S_AXIS_0
create_bd_intf_pin -mode Master -vlnv xilinx.com:interface:axis_rtl:1.0 m0_axis
create_bd_pin -dir I -type clk M00_AXIS_ACLK
create_bd_pin -dir I -type rst M00_AXIS_ARESETN
create_bd_pin -dir I mode_select_i
create_bd_pin -dir I -from 8 -to 0 i_stat_tx_pause_valid_0
create_bd_pin -dir O -from 8 -to 0 o_ctl_tx_pause_req_0
create_bd_pin -dir O o_ctl_tx_resend_pause_0
create_bd_pin -dir I -type rst s_axis_aresetn_0
create_bd_pin -dir I -type clk s_axis_aclk_0

create_bd_cell -type module -reference mode_selection mode_selection_0
create_bd_cell -type module -reference mac_flow_control mac_flow_control_0
create_bd_cell -type ip -vlnv xilinx.com:ip:axis_data_fifo:2.0 axis_data_fifo_0
set_property -dict [list \
  CONFIG.FIFO_DEPTH 256 \
  CONFIG.FIFO_MODE 2 \
  CONFIG.HAS_TKEEP 1 \
  CONFIG.TDATA_NUM_BYTES 8 \
] [get_bd_cells axis_data_fifo_0]
create_bd_cell -type module -reference mac_traffic_control mac_traffic_control_0
create_bd_cell -type ip -vlnv xilinx.com:ip:axis_data_fifo:2.0 axis_data_fifo_1
set_property -dict [list \
  CONFIG.FIFO_DEPTH 2048 \
  CONFIG.FIFO_MODE 2 \
  CONFIG.HAS_PROG_EMPTY 1 \
  CONFIG.HAS_PROG_FULL 1 \
  CONFIG.HAS_TKEEP 1 \
  CONFIG.PROG_EMPTY_THRESH 800 \
  CONFIG.PROG_FULL_THRESH 1800 \
  CONFIG.TDATA_NUM_BYTES 8 \
  CONFIG.TDEST_WIDTH 11 \
] [get_bd_cells axis_data_fifo_1]
create_bd_cell -type ip -vlnv xilinx.com:ip:axis_data_fifo:2.0 axis_data_fifo_2
set_property -dict [list \
  CONFIG.FIFO_DEPTH 256 \
  CONFIG.FIFO_MODE 2 \
  CONFIG.HAS_TKEEP 1 \
  CONFIG.TDATA_NUM_BYTES 16 \
  CONFIG.TDEST_WIDTH 11 \
] [get_bd_cells axis_data_fifo_2]
create_bd_cell -type ip -vlnv xilinx.com:ip:axis_register_slice:1.1 axis_register_slice_0
set_property -dict [list \
  CONFIG.HAS_TKEEP 1 \
  CONFIG.HAS_TLAST 1 \
  CONFIG.HAS_TREADY 1 \
  CONFIG.TDATA_NUM_BYTES 16 \
  CONFIG.TDEST_WIDTH 11 \
] [get_bd_cells axis_register_slice_0]
create_bd_cell -type ip -vlnv xilinx.com:ip:util_vector_logic:2.0 util_vector_logic_1
set_property -dict {CONFIG.C_OPERATION not CONFIG.C_SIZE 1} [get_bd_cells util_vector_logic_1]
create_bd_cell -type ip -vlnv xilinx.com:ip:xlconstant:1.1 xlconstant_0
set_property -dict {CONFIG.CONST_VAL 0 CONFIG.CONST_WIDTH 11} [get_bd_cells xlconstant_0]
create_bd_cell -type ip -vlnv xilinx.com:ip:axis_interconnect:2.1 axis_interconnect_0
set_property -dict [list \
  CONFIG.ARB_ON_TLAST 1 \
  CONFIG.M00_AXIS_HIGHTDEST 0x00000003 \
  CONFIG.M00_FIFO_DEPTH 512 \
  CONFIG.M00_FIFO_MODE 1 \
  CONFIG.M00_HAS_REGSLICE 1 \
  CONFIG.NUM_MI 1 \
  CONFIG.S00_FIFO_DEPTH 512 \
  CONFIG.S00_FIFO_MODE 1 \
  CONFIG.S00_HAS_REGSLICE 1 \
] [get_bd_cells axis_interconnect_0]

# ---- hierarchy /to_MAC00_is_MAC0 ----
current_bd_instance /to_MAC00_is_MAC0
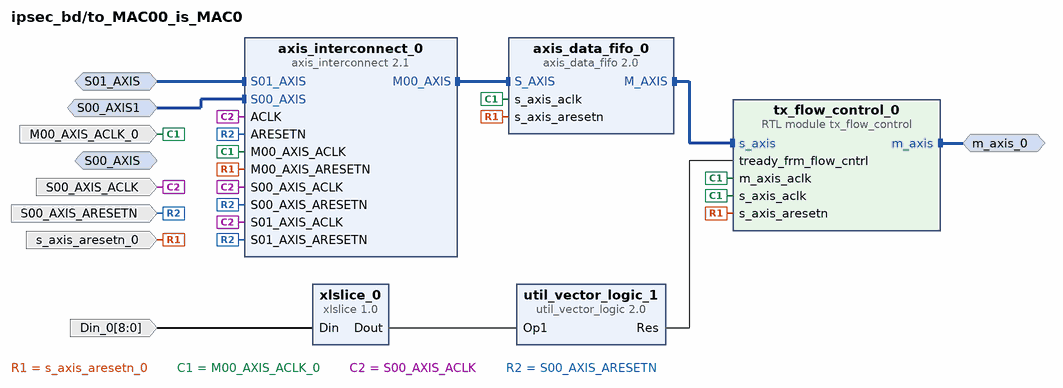
[diagram p9: block diagram inside /to_MAC00_is_MAC0]
create_bd_intf_pin -mode Master -vlnv xilinx.com:interface:axis_rtl:1.0 m_axis_0
create_bd_intf_pin -mode Slave -vlnv xilinx.com:interface:axis_rtl:1.0 S00_AXIS
create_bd_intf_pin -mode Slave -vlnv xilinx.com:interface:axis_rtl:1.0 S01_AXIS
create_bd_intf_pin -mode Slave -vlnv xilinx.com:interface:axis_rtl:1.0 S00_AXIS1
create_bd_pin -dir I -type clk M00_AXIS_ACLK_0
create_bd_pin -dir I -from 8 -to 0 Din_0
create_bd_pin -dir I -type clk S00_AXIS_ACLK
create_bd_pin -dir I -type rst S00_AXIS_ARESETN
create_bd_pin -dir I -type rst s_axis_aresetn_0

create_bd_cell -type ip -vlnv xilinx.com:ip:axis_data_fifo:2.0 axis_data_fifo_0
set_property -dict [list \
  CONFIG.FIFO_DEPTH 256 \
  CONFIG.FIFO_MODE 2 \
  CONFIG.HAS_TKEEP 1 \
  CONFIG.TDATA_NUM_BYTES 8 \
] [get_bd_cells axis_data_fifo_0]
create_bd_cell -type module -reference tx_flow_control tx_flow_control_0
create_bd_cell -type ip -vlnv xilinx.com:ip:xlslice:1.0 xlslice_0
set_property -dict {CONFIG.DIN_FROM 8 CONFIG.DIN_TO 8 CONFIG.DIN_WIDTH 9 CONFIG.DOUT_WIDTH 1} [get_bd_cells xlslice_0]
create_bd_cell -type ip -vlnv xilinx.com:ip:util_vector_logic:2.0 util_vector_logic_1
set_property -dict {CONFIG.C_OPERATION not CONFIG.C_SIZE 1} [get_bd_cells util_vector_logic_1]
create_bd_cell -type ip -vlnv xilinx.com:ip:axis_interconnect:2.1 axis_interconnect_0
set_property -dict [list \
  CONFIG.ARB_ON_TLAST 1 \
  CONFIG.M00_AXIS_HIGHTDEST 0x00000003 \
  CONFIG.M00_FIFO_DEPTH 512 \
  CONFIG.M00_FIFO_MODE 1 \
  CONFIG.M00_HAS_REGSLICE 1 \
  CONFIG.M01_AXIS_BASETDEST 0x00000000 \
  CONFIG.M01_FIFO_DEPTH 512 \
  CONFIG.M01_FIFO_MODE 1 \
  CONFIG.M01_HAS_REGSLICE 1 \
  CONFIG.NUM_MI 1 \
  CONFIG.NUM_SI 2 \
  CONFIG.S00_FIFO_DEPTH 512 \
  CONFIG.S00_FIFO_MODE 1 \
  CONFIG.S00_HAS_REGSLICE 1 \
  CONFIG.S01_FIFO_DEPTH 512 \
  CONFIG.S01_FIFO_MODE 1 \
  CONFIG.S01_HAS_REGSLICE 1 \
] [get_bd_cells axis_interconnect_0]

# ---- connections ----

current_bd_instance /header_fifo
connect_bd_net [get_bd_pins clk] \
  [get_bd_pins fifo_generator_ip_hdr/clk] [get_bd_pins fifo_generator_mac_hdr/clk] [get_bd_pins fifo_generator_vlan/clk] \
  [get_bd_pins fifo_generator_ingrs_port/clk] [get_bd_pins fifo_generator_tag_sad/clk] \
  [get_bd_pins fifo_generator_slow_path_flag/clk]
connect_bd_net -net util_vector_logic_0_Res [get_bd_pins srst] \
  [get_bd_pins fifo_generator_ip_hdr/srst] [get_bd_pins fifo_generator_mac_hdr/srst] [get_bd_pins fifo_generator_vlan/srst] \
  [get_bd_pins fifo_generator_ingrs_port/srst] [get_bd_pins fifo_generator_tag_sad/srst] \
  [get_bd_pins fifo_generator_slow_path_flag/srst]
connect_bd_net -net metadata_extraction_0_mac_hdr [get_bd_pins din] [get_bd_pins fifo_generator_mac_hdr/din]
connect_bd_net -net metadata_extraction_0_valid_out [get_bd_pins wr_en] \
  [get_bd_pins fifo_generator_ip_hdr/wr_en] [get_bd_pins fifo_generator_mac_hdr/wr_en] \
  [get_bd_pins fifo_generator_vlan/wr_en] [get_bd_pins fifo_generator_ingrs_port/wr_en] \
  [get_bd_pins fifo_generator_tag_sad/wr_en]
connect_bd_net -net metadata_extraction_0_ip_hdr [get_bd_pins din2] [get_bd_pins fifo_generator_ip_hdr/din]
connect_bd_net [get_bd_pins fifo_generator_ip_hdr/dout] [get_bd_pins dout]
connect_bd_net [get_bd_pins rd_en] \
  [get_bd_pins fifo_generator_ip_hdr/rd_en] [get_bd_pins fifo_generator_mac_hdr/rd_en] \
  [get_bd_pins fifo_generator_vlan/rd_en] [get_bd_pins fifo_generator_ingrs_port/rd_en] \
  [get_bd_pins fifo_generator_slow_path_flag/rd_en] [get_bd_pins fifo_generator_tag_sad/rd_en]
connect_bd_net [get_bd_pins fifo_generator_mac_hdr/dout] [get_bd_pins dout2]
connect_bd_net [get_bd_pins xlconcat_0/dout] [get_bd_pins fifo_generator_vlan/din]
connect_bd_net -net In1_1 [get_bd_pins In1] [get_bd_pins xlconcat_0/In1]
connect_bd_net -net In0_1 [get_bd_pins In0] [get_bd_pins xlconcat_0/In0]
connect_bd_net [get_bd_pins fifo_generator_vlan/dout] [get_bd_pins dout5]
connect_bd_net -net fifo_generator_egrs_port_dout [get_bd_pins fifo_generator_ingrs_port/dout] [get_bd_pins dout3]
connect_bd_net -net din4_1 [get_bd_pins din4] [get_bd_pins fifo_generator_ingrs_port/din]
connect_bd_net -net din5_1 [get_bd_pins din5] [get_bd_pins fifo_generator_tag_sad/din]
connect_bd_net -net wr_en1_1 [get_bd_pins wr_en1] [get_bd_pins fifo_generator_slow_path_flag/wr_en]
connect_bd_net -net din1_1 [get_bd_pins din1] [get_bd_pins fifo_generator_slow_path_flag/din]
connect_bd_net [get_bd_pins fifo_generator_tag_sad/dout] [get_bd_pins dout1]
connect_bd_net [get_bd_pins fifo_generator_slow_path_flag/dout] [get_bd_pins dout4]

current_bd_instance /ENC_SAD
connect_bd_intf_net [get_bd_intf_pins S_AXIS] [get_bd_intf_pins axis_data_fifo_ENC_SAD/S_AXIS]
connect_bd_intf_net [get_bd_intf_pins s_axi] [get_bd_intf_pins DEC_SAD/s_axi]
connect_bd_net -net axis_data_fifo_0_m_axis_tvalid [get_bd_pins axis_data_fifo_ENC_SAD/m_axis_tvalid] \
  [get_bd_pins axis_register_slice_ENC_SAD/s_axis_tvalid]
connect_bd_net [get_bd_pins axis_register_slice_ENC_SAD/s_axis_tready] [get_bd_pins axis_data_fifo_ENC_SAD/m_axis_tready]
connect_bd_net -net axis_data_fifo_0_m_axis_tdata [get_bd_pins axis_data_fifo_ENC_SAD/m_axis_tdata] \
  [get_bd_pins axis_register_slice_ENC_SAD/s_axis_tdata]
connect_bd_net -net axis_data_fifo_0_m_axis_tkeep [get_bd_pins axis_data_fifo_ENC_SAD/m_axis_tkeep] \
  [get_bd_pins axis_register_slice_ENC_SAD/s_axis_tkeep]
connect_bd_net -net axis_data_fifo_0_m_axis_tlast [get_bd_pins axis_data_fifo_ENC_SAD/m_axis_tlast] \
  [get_bd_pins axis_register_slice_ENC_SAD/s_axis_tlast]
connect_bd_net -net xlconstant_0_dout [get_bd_pins xlconstant_ENC_SAD_0/dout] [get_bd_pins axis_register_slice_ENC_SAD/s_axis_tuser]
connect_bd_net [get_bd_pins cam_mem_aclk] \
  [get_bd_pins axis_data_fifo_ENC_SAD/s_axis_aclk] [get_bd_pins axis_register_slice_ENC_SAD/aclk] \
  [get_bd_pins P4_in_VALID_gen_block_0/s_axis_aclk] [get_bd_pins P4_in_VALID_gen_block_0/m_axis_aclk] \
  [get_bd_pins DEC_SAD/cam_mem_aclk] [get_bd_pins DEC_SAD/s_axi_aclk] [get_bd_pins DEC_SAD/s_axis_aclk]
connect_bd_net [get_bd_pins s_axis_aresetn] \
  [get_bd_pins axis_data_fifo_ENC_SAD/s_axis_aresetn] [get_bd_pins axis_register_slice_ENC_SAD/aresetn] \
  [get_bd_pins P4_in_VALID_gen_block_0/s_axis_aresetn] [get_bd_pins DEC_SAD/cam_mem_aresetn] \
  [get_bd_pins DEC_SAD/s_axi_aresetn] [get_bd_pins DEC_SAD/s_axis_aresetn]
connect_bd_net [get_bd_pins P4_in_VALID_gen_block_0/m_axis_tdata] [get_bd_pins DEC_SAD/s_axis_tdata]
connect_bd_net [get_bd_pins P4_in_VALID_gen_block_0/m_axis_tkeep] [get_bd_pins DEC_SAD/s_axis_tkeep]
connect_bd_net [get_bd_pins P4_in_VALID_gen_block_0/m_axis_tlast] [get_bd_pins DEC_SAD/s_axis_tlast]
connect_bd_net [get_bd_pins P4_in_VALID_gen_block_0/m_axis_tvalid] [get_bd_pins DEC_SAD/s_axis_tvalid]
connect_bd_net [get_bd_pins P4_in_VALID_gen_block_0/Tdest_valid_out] [get_bd_pins DEC_SAD/user_metadata_in_valid]
connect_bd_net [get_bd_pins P4_in_VALID_gen_block_0/m_axis_tdest] [get_bd_pins DEC_SAD/user_metadata_in]
connect_bd_net [get_bd_pins axis_register_slice_ENC_SAD/m_axis_tvalid] [get_bd_pins P4_in_VALID_gen_block_0/s_axis_tvalid]
connect_bd_net [get_bd_pins P4_in_VALID_gen_block_0/s_axis_tready] [get_bd_pins axis_register_slice_ENC_SAD/m_axis_tready]
connect_bd_net [get_bd_pins axis_register_slice_ENC_SAD/m_axis_tdata] [get_bd_pins P4_in_VALID_gen_block_0/s_axis_tdata]
connect_bd_net [get_bd_pins axis_register_slice_ENC_SAD/m_axis_tkeep] [get_bd_pins P4_in_VALID_gen_block_0/s_axis_tkeep]
connect_bd_net [get_bd_pins axis_register_slice_ENC_SAD/m_axis_tlast] [get_bd_pins P4_in_VALID_gen_block_0/s_axis_tlast]
connect_bd_net [get_bd_pins axis_register_slice_ENC_SAD/m_axis_tuser] [get_bd_pins P4_in_VALID_gen_block_0/s_axis_tdest]
connect_bd_net -net sdnet_0_s_axis_tready [get_bd_pins DEC_SAD/s_axis_tready] [get_bd_pins P4_in_VALID_gen_block_0/m_axis_tready]
connect_bd_net -net sdnet_0_m_axis_tdata [get_bd_pins DEC_SAD/m_axis_tdata] [get_bd_pins m_axis_tdata]
connect_bd_net -net sdnet_0_m_axis_tkeep [get_bd_pins DEC_SAD/m_axis_tkeep] [get_bd_pins m_axis_tkeep]
connect_bd_net -net sdnet_0_m_axis_tlast [get_bd_pins DEC_SAD/m_axis_tlast] [get_bd_pins m_axis_tlast]
connect_bd_net -net sdnet_0_m_axis_tvalid [get_bd_pins DEC_SAD/m_axis_tvalid] [get_bd_pins m_axis_tvalid]
connect_bd_net -net demux_logic_0_s_axis_tready [get_bd_pins m_axis_tready] [get_bd_pins DEC_SAD/m_axis_tready]
connect_bd_net [get_bd_pins DEC_SAD/user_metadata_out] [get_bd_pins user_metadata_out]
connect_bd_net [get_bd_pins DEC_SAD/user_metadata_out_valid] [get_bd_pins user_metadata_out_valid]

current_bd_instance /dec_input_formation
connect_bd_intf_net [get_bd_intf_pins axis_register_slice_1/M_AXIS] [get_bd_intf_pins esp_trailer_addition_0/s_axis]
connect_bd_intf_net [get_bd_intf_pins S_AXIS] [get_bd_intf_pins axis_register_slice_1/S_AXIS]
connect_bd_net [get_bd_pins clk] [get_bd_pins esp_trailer_addition_0/s_axis_aclk] [get_bd_pins axis_register_slice_1/aclk]
connect_bd_net [get_bd_pins aresetn] [get_bd_pins esp_trailer_addition_0/s_axis_aresetn] [get_bd_pins axis_register_slice_1/aresetn]
connect_bd_net [get_bd_pins esp_trailer_addition_0/length_bytes_o] [get_bd_pins length_bytes_o]
connect_bd_net [get_bd_pins esp_trailer_addition_0/length_valid_o] [get_bd_pins length_valid_o]
connect_bd_net -net metadata_extraction_0_valid_out [get_bd_pins metadata_extraction_1/dec_valid_out] [get_bd_pins valid_out]
connect_bd_net [get_bd_pins esp_trailer_addition_0/m_axis_tdata] [get_bd_pins m_axis_tdata1]
connect_bd_net [get_bd_pins esp_trailer_addition_0/m_axis_tlast] [get_bd_pins m_axis_tlast1]
connect_bd_net -net m_axis_tready1_1 [get_bd_pins m_axis_tready1] [get_bd_pins esp_trailer_addition_0/m_axis_tready]
connect_bd_net [get_bd_pins esp_trailer_addition_0/m_axis_tvalid] [get_bd_pins m_axis_tvalid1]
connect_bd_net [get_bd_pins dec_sad_p4_metadata] [get_bd_pins metadata_extraction_1/dec_sad_p4_metadata]
connect_bd_net [get_bd_pins dec_sad_p4_metadata_valid] [get_bd_pins metadata_extraction_1/dec_sad_p4_metadata_valid]
connect_bd_net [get_bd_pins metadata_extraction_1/vlan_hdr] [get_bd_pins vlan_hdr]
connect_bd_net [get_bd_pins metadata_extraction_1/ip_hdr] [get_bd_pins ip_hdr]
connect_bd_net [get_bd_pins metadata_extraction_1/mac_hdr] [get_bd_pins mac_hdr]
connect_bd_net [get_bd_pins metadata_extraction_1/pkt_len] [get_bd_pins pkt_len]
connect_bd_net [get_bd_pins metadata_extraction_1/vlan_present] [get_bd_pins vlan_present]
connect_bd_net [get_bd_pins metadata_extraction_1/ingress] [get_bd_pins ingress]
connect_bd_net [get_bd_pins metadata_extraction_1/key] [get_bd_pins key]
connect_bd_net [get_bd_pins metadata_extraction_1/en_decryption] [get_bd_pins en_decryption]
connect_bd_net [get_bd_pins metadata_extraction_1/tag] [get_bd_pins tag]
connect_bd_net [get_bd_pins metadata_extraction_1/iv] [get_bd_pins iv]
connect_bd_net [get_bd_pins metadata_extraction_1/aad] [get_bd_pins aad]

current_bd_instance /enc
connect_bd_net -net iv_seq_nmbr_cache_0_iv [get_bd_pins din] [get_bd_pins fifo_generator_iv1/din]
connect_bd_net -net metadata_extraction_0_key [get_bd_pins din2] [get_bd_pins fifo_generator_enc_key1/din]
connect_bd_net -net metadata_extraction_0_valid_out [get_bd_pins wr_en2] \
  [get_bd_pins fifo_generator_enc_key1/wr_en] [get_bd_pins fifo_generator_iv1/wr_en] \
  [get_bd_pins fifo_generator_spi_seq_aad1/wr_en]
connect_bd_net -net esp_trailer_addition_0_length_bytes_o [get_bd_pins din4] \
  [get_bd_pins fifo_generator_plain_txt_len_enc_in1/din] [get_bd_pins fifo_generator_cipher_txt_len_enc_out/din]
connect_bd_net -net esp_trailer_addition_0_length_valid_o [get_bd_pins wr_en4] \
  [get_bd_pins fifo_generator_plain_txt_len_enc_in1/wr_en] [get_bd_pins fifo_generator_cipher_txt_len_enc_out/wr_en]
connect_bd_net [get_bd_pins xlconstant_2/dout] [get_bd_pins xlconcat_1/In1]
connect_bd_net [get_bd_pins fifo_generator_cipher_txt_len_enc_out/dout] [get_bd_pins dout]
connect_bd_net [get_bd_pins fifo_generator_cipher_txt_len_enc_out/empty] [get_bd_pins empty]
connect_bd_net [get_bd_pins rd_en] [get_bd_pins fifo_generator_cipher_txt_len_enc_out/rd_en]
connect_bd_net -net rd_en1_1 [get_bd_pins rd_en1] [get_bd_pins fifo_generator_tag_enc_out/rd_en]
connect_bd_net [get_bd_pins fifo_generator_tag_enc_out/empty] [get_bd_pins empty1]
connect_bd_net [get_bd_pins fifo_generator_tag_enc_out/dout] [get_bd_pins dout1]
connect_bd_net [get_bd_pins fifo_generator_cipher_txt_enc_out/dout] [get_bd_pins dout2]
connect_bd_net -net rd_en2_1 [get_bd_pins rd_en2] [get_bd_pins fifo_generator_cipher_txt_enc_out/rd_en]
connect_bd_net [get_bd_pins wr_clk] \
  [get_bd_pins axis_data_fifo_plain_txt_enc_in1/s_axis_aclk] [get_bd_pins axis_data_fifo_plain_txt_enc_in2/s_axis_aclk] \
  [get_bd_pins fifo_generator_iv1/clk] [get_bd_pins fifo_generator_enc_key1/clk] \
  [get_bd_pins fifo_generator_plain_txt_len_enc_in1/clk] [get_bd_pins fifo_generator_tag_enc_out/clk] \
  [get_bd_pins fifo_generator_cipher_txt_enc_out/clk] [get_bd_pins fifo_generator_cipher_txt_len_enc_out/clk] \
  [get_bd_pins aes_gcm_dec_0/ap_clk] [get_bd_pins fifo_generator_spi_seq_aad1/clk]
connect_bd_net [get_bd_pins ap_rst] \
  [get_bd_pins fifo_generator_enc_key1/srst] [get_bd_pins fifo_generator_plain_txt_len_enc_in1/srst] \
  [get_bd_pins fifo_generator_tag_enc_out/srst] [get_bd_pins fifo_generator_cipher_txt_enc_out/srst] \
  [get_bd_pins fifo_generator_cipher_txt_len_enc_out/srst] [get_bd_pins fifo_generator_iv1/srst] \
  [get_bd_pins fifo_generator_spi_seq_aad1/srst]
connect_bd_net [get_bd_pins s_axis_aresetn] \
  [get_bd_pins axis_data_fifo_plain_txt_enc_in1/s_axis_aresetn] [get_bd_pins axis_data_fifo_plain_txt_enc_in2/s_axis_aresetn] \
  [get_bd_pins aes_gcm_dec_0/ap_rst_n]
connect_bd_net [get_bd_pins util_vector_logic_9/Res] [get_bd_pins util_vector_logic_8/Op2]
connect_bd_net [get_bd_pins axis_data_fifo_plain_txt_enc_in1/s_axis_tready] [get_bd_pins util_vector_logic_8/Op1]
connect_bd_net [get_bd_pins util_vector_logic_8/Res] [get_bd_pins util_vector_logic_1/Op1] [get_bd_pins Res]
connect_bd_net [get_bd_pins axis_data_fifo_plain_txt_enc_in2/m_axis_tdata] [get_bd_pins aes_gcm_dec_0/ctext_st_V_TDATA]
connect_bd_net [get_bd_pins axis_data_fifo_plain_txt_enc_in2/m_axis_tvalid] [get_bd_pins aes_gcm_dec_0/ctext_st_V_TVALID]
connect_bd_net [get_bd_pins xlconstant_5/dout] [get_bd_pins xlconcat_2/In0]
connect_bd_net [get_bd_pins util_vector_logic_0/Res] [get_bd_pins util_vector_logic_10/Op1] [get_bd_pins aes_gcm_dec_0/iv_st_V_TVALID]
connect_bd_net [get_bd_pins xlconcat_2/dout] [get_bd_pins aes_gcm_dec_0/iv_st_V_TDATA]
connect_bd_net [get_bd_pins util_vector_logic_10/Res] [get_bd_pins fifo_generator_iv1/rd_en]
connect_bd_net [get_bd_pins fifo_generator_iv1/full] [get_bd_pins util_vector_logic_9/Op1]
connect_bd_net [get_bd_pins fifo_generator_iv1/empty] [get_bd_pins util_vector_logic_0/Op1]
connect_bd_net [get_bd_pins fifo_generator_iv1/dout] [get_bd_pins xlconcat_2/In1]
connect_bd_net [get_bd_pins util_vector_logic_13/Res] [get_bd_pins util_vector_logic_12/Op1] [get_bd_pins aes_gcm_dec_0/aad_st_V_TVALID]
connect_bd_net [get_bd_pins xlconcat_0/dout] [get_bd_pins aes_gcm_dec_0/aad_st_V_TDATA]
connect_bd_net [get_bd_pins xlconstant_0/dout] [get_bd_pins xlconcat_0/In0]
connect_bd_net -net aes_gcm_enc_0_ap_ready [get_bd_pins aes_gcm_dec_0/ap_ready] \
  [get_bd_pins fifo_generator_enc_key1/rd_en] [get_bd_pins fifo_generator_plain_txt_len_enc_in1/rd_en]
connect_bd_net [get_bd_pins fifo_generator_enc_key1/dout] [get_bd_pins aes_gcm_dec_0/key_256]
connect_bd_net [get_bd_pins util_vector_logic_15/Res] [get_bd_pins aes_gcm_dec_0/ap_start]
connect_bd_net [get_bd_pins xlconstant_6/dout] [get_bd_pins aes_gcm_dec_0/key_type]
connect_bd_net [get_bd_pins xlconstant_8/dout] [get_bd_pins aes_gcm_dec_0/aad_len]
connect_bd_net [get_bd_pins xlconstant_7/dout] [get_bd_pins aes_gcm_dec_0/iv_len]
connect_bd_net [get_bd_pins fifo_generator_plain_txt_len_enc_in1/dout] [get_bd_pins xlconcat_1/In0]
connect_bd_net [get_bd_pins xlconcat_1/dout] [get_bd_pins aes_gcm_dec_0/ptext_len]
connect_bd_net [get_bd_pins util_vector_logic_18/Res] [get_bd_pins util_vector_logic_17/Op2] [get_bd_pins aes_gcm_dec_0/ptext_st_V_TREADY]
connect_bd_net [get_bd_pins fifo_generator_cipher_txt_enc_out/full] [get_bd_pins util_vector_logic_18/Op1]
connect_bd_net [get_bd_pins util_vector_logic_17/Res] [get_bd_pins fifo_generator_cipher_txt_enc_out/wr_en]
connect_bd_net [get_bd_pins axis_data_fifo_plain_txt_enc_in1/m_axis_tdata] [get_bd_pins axis_data_fifo_plain_txt_enc_in2/s_axis_tdata]
connect_bd_net [get_bd_pins axis_data_fifo_plain_txt_enc_in1/m_axis_tlast] [get_bd_pins axis_data_fifo_plain_txt_enc_in2/s_axis_tlast]
connect_bd_net [get_bd_pins axis_data_fifo_plain_txt_enc_in2/s_axis_tready] [get_bd_pins axis_data_fifo_plain_txt_enc_in1/m_axis_tready]
connect_bd_net [get_bd_pins axis_data_fifo_plain_txt_enc_in1/m_axis_tvalid] [get_bd_pins axis_data_fifo_plain_txt_enc_in2/s_axis_tvalid]
connect_bd_net [get_bd_pins fifo_generator_plain_txt_len_enc_in1/empty] [get_bd_pins util_vector_logic_15/Op1]
connect_bd_net -net s_axis_tdata1_1 [get_bd_pins s_axis_tdata1] [get_bd_pins axis_data_fifo_plain_txt_enc_in1/s_axis_tdata]
connect_bd_net -net s_axis_tlast1_1 [get_bd_pins s_axis_tlast1] [get_bd_pins axis_data_fifo_plain_txt_enc_in1/s_axis_tlast]
connect_bd_net [get_bd_pins util_vector_logic_1/Res] [get_bd_pins axis_data_fifo_plain_txt_enc_in1/s_axis_tvalid]
connect_bd_net -net Op2_1 [get_bd_pins Op2] [get_bd_pins util_vector_logic_1/Op2]
connect_bd_net [get_bd_pins aes_gcm_dec_0/iv_st_V_TREADY] [get_bd_pins util_vector_logic_10/Op2]
connect_bd_net [get_bd_pins aes_gcm_dec_0/ctext_st_V_TREADY] [get_bd_pins axis_data_fifo_plain_txt_enc_in2/m_axis_tready]
connect_bd_net [get_bd_pins aes_gcm_dec_0/aad_st_V_TREADY] [get_bd_pins util_vector_logic_12/Op2]
connect_bd_net [get_bd_pins aes_gcm_dec_0/ptext_st_V_TVALID] [get_bd_pins util_vector_logic_17/Op1]
connect_bd_net [get_bd_pins aes_gcm_dec_0/ptext_st_V_TDATA] [get_bd_pins fifo_generator_cipher_txt_enc_out/din]
connect_bd_net [get_bd_pins aes_gcm_dec_0/tag_ap_vld] [get_bd_pins fifo_generator_tag_enc_out/wr_en]
connect_bd_net [get_bd_pins aes_gcm_dec_0/tag] [get_bd_pins fifo_generator_tag_enc_out/din]
connect_bd_net [get_bd_pins fifo_generator_spi_seq_aad1/empty] [get_bd_pins util_vector_logic_13/Op1]
connect_bd_net [get_bd_pins fifo_generator_spi_seq_aad1/dout] [get_bd_pins xlconcat_0/In1]
connect_bd_net [get_bd_pins util_vector_logic_12/Res] [get_bd_pins fifo_generator_spi_seq_aad1/rd_en]
connect_bd_net -net din1_1 [get_bd_pins din1] [get_bd_pins fifo_generator_spi_seq_aad1/din]
